# Altium schematic sheet ADC_MUX.SchDoc
size A
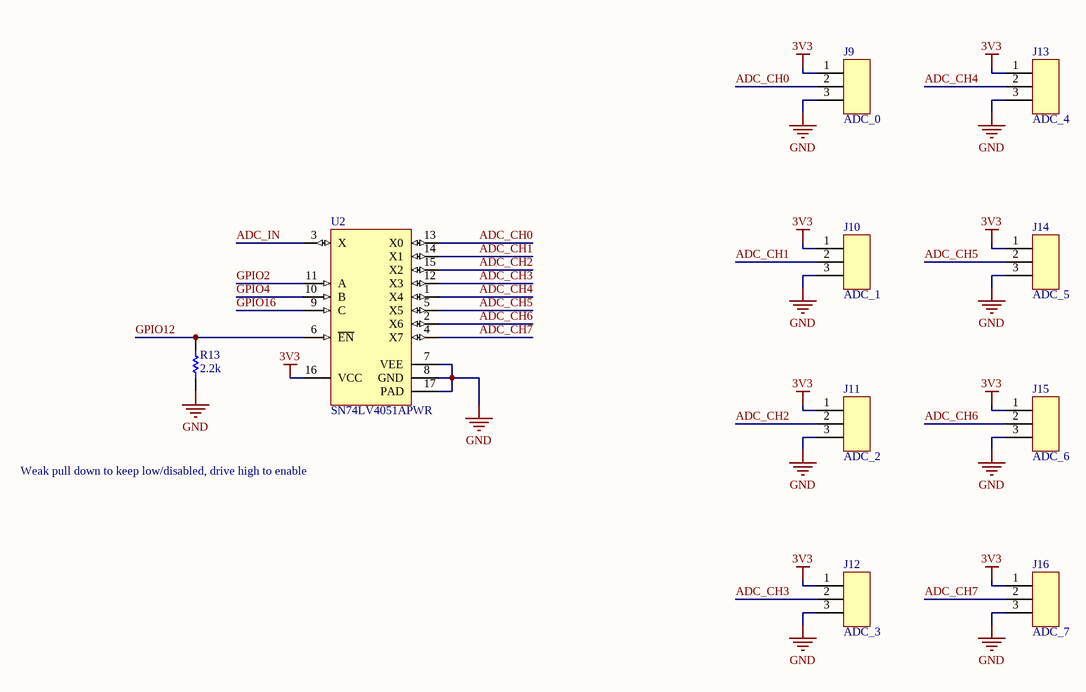
[diagram p0: ADC_MUX.SchDoc]

## Parts
J9  ADC_0  [PCB-s0hfil65plaomi4ibvcw-1]
J10  ADC_1  [PCB-s0hfil65plaomi4ibvcw-1]
J11  ADC_2  [PCB-s0hfil65plaomi4ibvcw-1]
J12  ADC_3  [PCB-s0hfil65plaomi4ibvcw-1]
J13  ADC_4  [PCB-s0hfil65plaomi4ibvcw-1]
J14  ADC_5  [PCB-s0hfil65plaomi4ibvcw-1]
J15  ADC_6  [PCB-s0hfil65plaomi4ibvcw-1]
J16  ADC_7  [PCB-s0hfil65plaomi4ibvcw-1]
R13  2.2k  [PCB-2t5lv6a742zfbi3344hk-1]
U2  SN74LV4051APWR  [PCB-s2tlwx05pg4l7j3eq4ax-1]

## Nets
3V3: J9.1 J10.1 J11.1 J12.1 J13.1 J14.1 J15.1 J16.1 U2.16(VCC)
GND: J9.3 J10.3 J11.3 J12.3 J13.3 J14.3 J15.3 J16.3 R13.1 U2.7(VEE) U2.8(GND) U2.17(PAD)
ADC_CH0: J9.2 U2.13(X0)
ADC_CH1: J10.2 U2.14(X1)
ADC_CH2: J11.2 U2.15(X2)
ADC_CH3: J12.2 U2.12(X3)
ADC_CH4: J13.2 U2.1(X4)
ADC_CH5: J14.2 U2.5(X5)
ADC_CH6: J15.2 U2.2(X6)
ADC_CH7: J16.2 U2.4(X7)
ADC_IN: U2.3(X)
GPIO2: U2.11(A)
GPIO4: U2.10(B)
GPIO12: R13.2 U2.6(~{EN})
GPIO16: U2.9(C)

## Notes on the sheet
- Weak pull down to keep low/disabled, drive high to enable

## Library data of the parts
J9-J16 = CMP-8a90426ffa175557-34: THT Vertical Pin Header WR-PHD, Pitch 2.54 mm, Single Row, 3 pins; Lead-Free Status: Lead Free; Dielectric Withstanding Voltage: 500 V; Orientation: Vertical
R13 = CMP-ce770211389311b0-1: Res, AEC-Q200, Thick Film, 2K2, 5%, 0603; Manufacturer Part Number: CRGCQ0603J2K2; Lifecycle Status: Not Listed by Manufacturer; Octopart URL: https://octopart.com/crgcq0603j2k2-te+connectivity-91018114; Packaging: Cut Tape (CT); Resistance Tolerance: ±5%; OctopartID: ce770211389311b0
U2 = CMP-2f9ae6973f1af05d-4: 5-V, 8: 1, 1-channel general-purpose analog multiplexer 16-TSSOP -40 to 85; Number of Circuits: 1; Polarity: Non-Inverting; Supply Current: 20.0 µA; Number of Channels: 8; Bandwidth: 35.0 MHz; Propagation Delay Max (tpd): 7.00 ns; Voltage Nodes: 5.00 V, 3.30 V, 2.50 V; Lead-Free Status: Lead Free; Quiescent Current: 20.0 µA (max); Supply Voltage (DC): 2.00 V to 5.50 V; OctopartID: 2f9ae6973f1af05d; Operating Temperature: 85.0 °C (max); Number of Pins: 16; Case/Package: TSSOP; Packaging: Cut Tape (CT), Tape & Reel (TR); REACH SVHC Compliance: No SVHC; Lifecycle Status: Active; Number of Bits: 8; RoHS: Compliant; Manufacturer Part Number: SN74LV4051APWR; Mounting Style: Surface Mount; Octopart URL: https://octopart.com/sn74lv4051apwr-texas+instruments-472550